# EAGLE design Side_Long_IXYS (EAGLE 9.6.2)
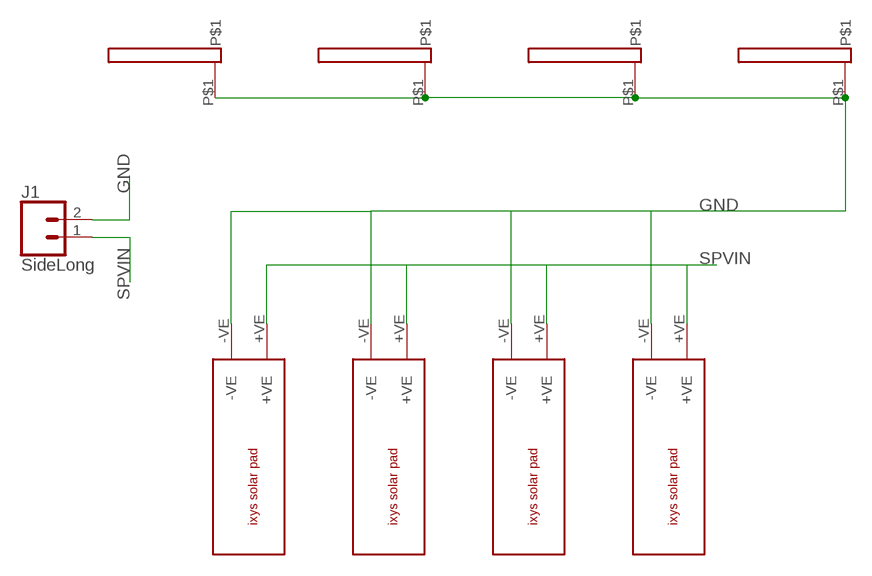
[diagram p0: schematic, sheet 1]

## Parts
J1  SideLong  CONN_02  [1X02]
U$1  16X2  [16X2]
U$2  16X2  [16X2]
U$3  16X2  [16X2]
U$4  16X2  [16X2]
U$9  IXYS  [IXYS]
U$10  IXYS  [IXYS]
U$11  IXYS  [IXYS]
U$12  IXYS  [IXYS]

## Nets
GND: J1.2 U$1.P$1 U$2.P$1 U$3.P$1 U$4.P$1 U$9.-VE U$10.-VE U$11.-VE U$12.-VE
SPVIN: J1.1 U$9.+VE U$10.+VE U$11.+VE U$12.+VE

## Library data of the parts
J1 = SparkFun-Connectors:CONN_02: Multi connection point. Often used as Generic Header-pin footprint for 0.1 inch spaced/style header connections On any of the 0.1 inch spaced packages, you can populate with these: Break Away Headers - Straight <https://www.sparkfun.com/products/116> (PRT-00116) Break Away Male Headers - Right Angle <https://www.sparkfun.com/products/553> (PRT-00553) Female Headers <https://www.sparkfun.com/products/115> (PRT-00115) Break Away Headers - Machine Pin <https://www.sparkfun.com/products/117> (PRT-00117) Break Away Female Headers - Swiss Machine Pin <https://www.sparkfun.com/products/743> (PRT-00743) For SCREWTERMINALS and SPRING TERMINALS visit here: Screw Terimnals on SparkFun.com <https://www.sparkfun.com/search/results?term=Screw+Terminals> (5mm/3.5mm/2.54mm spacing) This device is also useful as a general connection point to wire up your design to another part of your project. Our various solder wires solder well into these plated through hole pads. Hook-Up Wire - Assortment (Stranded, 22 AWG) <https://www.sparkfun.com/products/11375> (PRT-11375) Hook-Up Wire - Assortment (Solid Core, 22 AWG) <https://www.sparkfun.com/products/11367> (PRT-11367) View the entire wire category on our website here <https://www.sparkfun.com/categories/141> Special notes: Molex polarized connector foot print use with: PRT-08233 with associated crimp pins and housings. 2.54_SCREWTERM for use with PRT-10571. 3.5mm Screw Terminal footprints for PRT-08084 5mm Screw Terminal footprints for use with PRT-08432
U$1-U$4 = 16x2PAD:16X2: Pad for 90 degree solder
U$9-U$12 = ixys:IXYS

## Net classes
1 vcc: width 0.254 mm

## Board
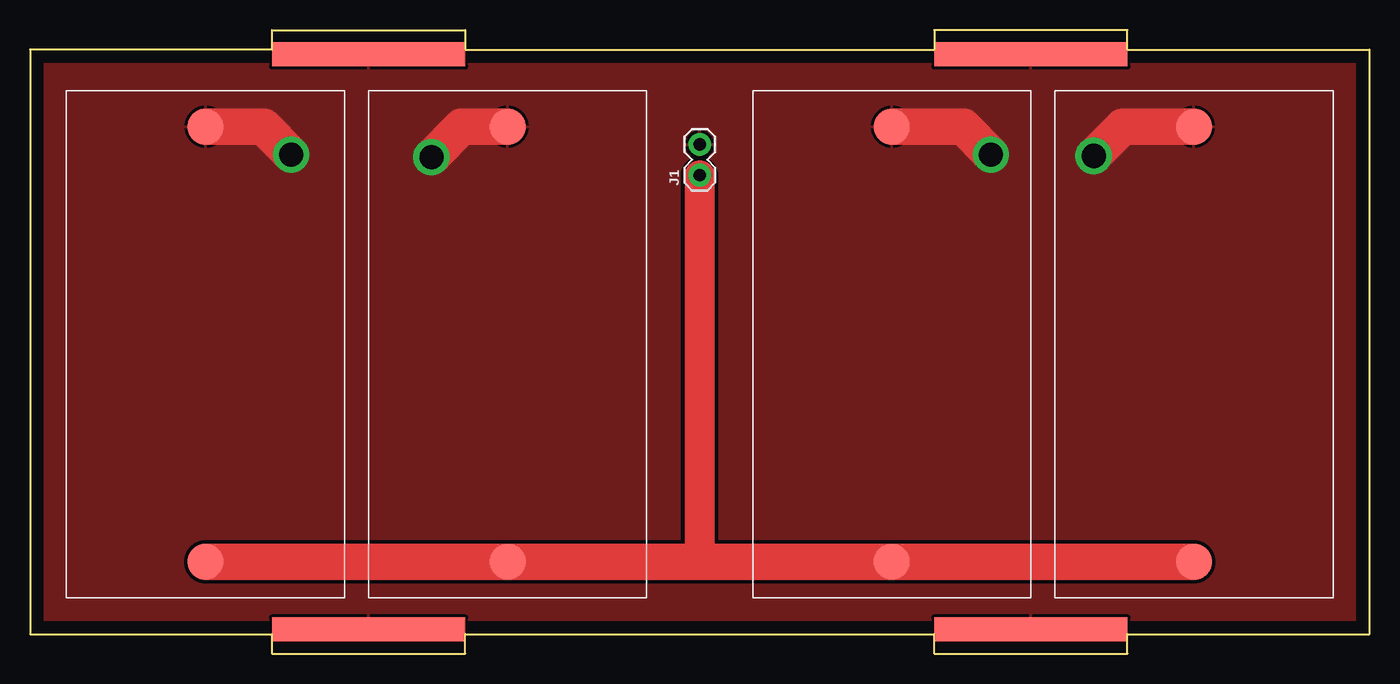
[diagram p1: board, top side]
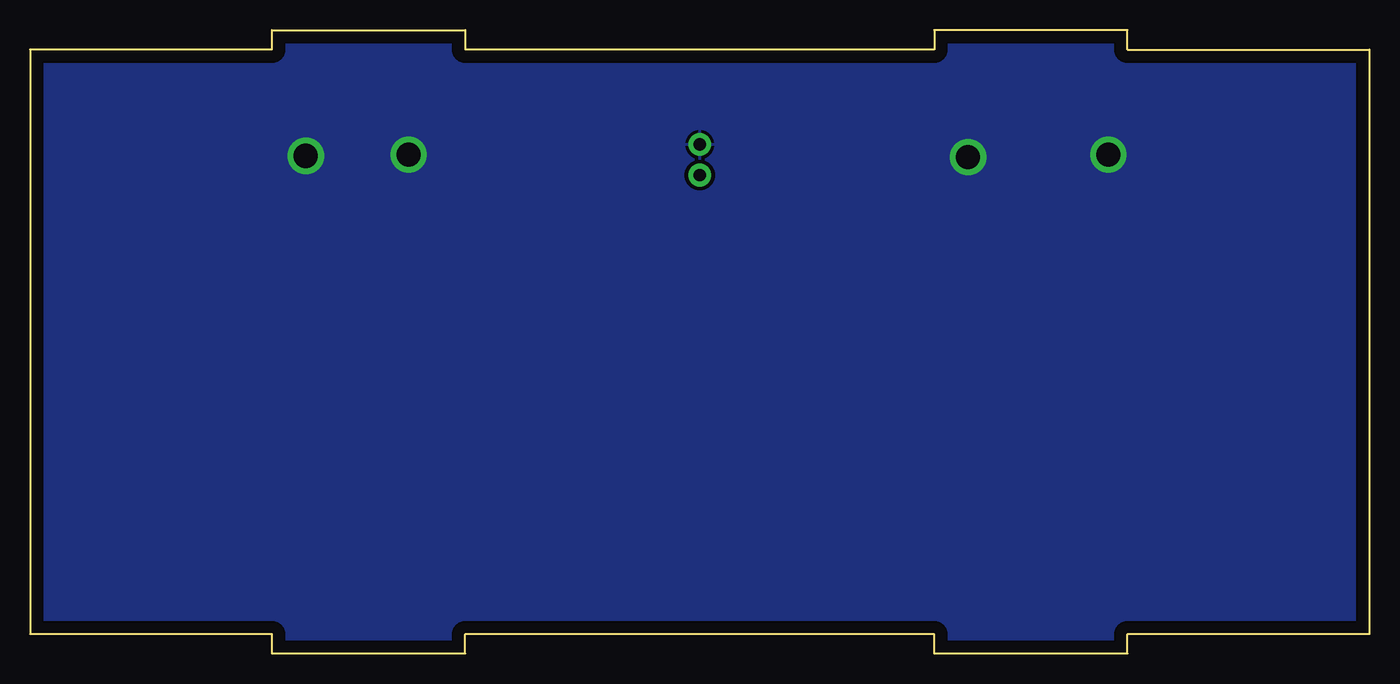
[diagram p2: board, bottom side, seen from below]

Size 110.8 x 51.6 mm. Coordinates in mm from the lower left corner, seen from the top.
Outline: 0,1.6 20,1.6 20,0 36,0 36,1.6 74.8,1.6 74.8,0 90.8,0 90.8,1.6 110.8,1.6 110.8,50 90.8,50 90.8,51.6 74.8,51.6 74.8,50 36,50 36,51.6 20,51.6 20,50 0,50 0,1.6
Copper layers (1*16): Top 0.035mm / dielectric 1.5mm / Bottom 0.035mm
Design rules "default *": minimum track width 6mil, minimum drill 0.35mm, track to track 12mil, track to pad 6mil, pad to pad 6mil, via to via 6mil, smd to smd 6mil, copper to edge 40mil, drill to drill 6mil, minimum pad ring 10mil, minimum via ring 8mil, stop-mask expansion 4mil, vias tented up to drill 0mil, thermal gap 10mil

### Footprints (pad centres in the part's own frame; a part is rotated, then mirrored left to right if it is on the bottom)
1X02 = drill 1.016 pad 1.88: 1 0,0; 2 2.54,0
16X2 = smd 16 x 2: P$1 0,0
IXYS = smd 3 x 3: +VE 3,11.5; -VE 39,11.5

### Placement (x,y rotation side)
J1  55.4,39.6 90 top
U$1  28,49.6 0 top
U$2  82.8,49.6 0 top
U$3  28,2 0 top
U$4  82.8,2 0 top
U$9  26,4.6 90 top
U$10  51,4.6 90 top
U$11  82.8,4.6 90 top
U$12  107.8,4.6 90 top

### Tracks (layer width: path | path; a pad name or v marks a point on that pad's centre or on a via)
GND  (via drill 2)
  Top 3: U$9.-VE 19.3,43.6 v21.6,41.3 | U$10.-VE 35.7,43.6 v33.2,41.1 | U$11.-VE 77.2,43.6 v79.5,41.3 | U$12.-VE 90.4,43.6 v88,41.2
  pour Top: -13.8,14.5 -13.8,47.5 5,66.3 105.4,66.3 124.8,46.9 124.8,5.2 108.7,-10.9 1.8,-10.9 -13.8,4.7
  pour Bottom: -12.9,5.2 -12.9,47.3 5.4,65.6 104.8,65.6 124,46.4 124,5.6 108.4,-10 2.2,-10 -12.9,5.1
SPVIN
  Top 2.5: J1.1 55.4,7.6
  Top 3: U$9.+VE U$10.+VE 55.4,7.6 U$11.+VE U$12.+VE